# Altium schematic sheet power.SchDoc
size A4
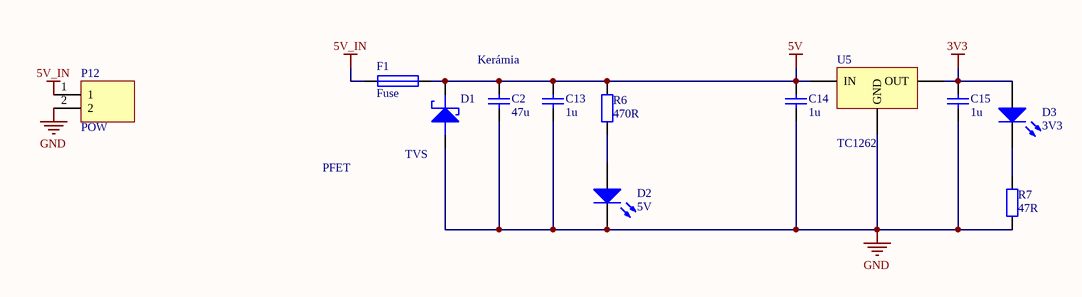
[diagram p0: power.SchDoc]

## Parts
C2  47u  [FP_0805_CAP_085]
C13  1u  [FP_0805_CAP_085]
C14  1u  [FP_0805_CAP_085]
C15  1u  [FP_0805_CAP_085]
D1  TVS  [FP_SMB]
D2  5V  [FP_0805_LED_GREEN]
D3  3V3  [FP_0805_LED_GREEN]
F1  Fuse  [FP_MULTIFUSE]
P12  POW  [FP_CONN2_TAP_254MM_90_NOPRINT]
R6  470R  [FP_0805_RES]
R7  47R  [FP_0805_RES]
U5  TC1262  [FP_SOT223]

## Nets
3V3: C15.2 D3.1(A) U5.3(OUT)
5V: C2.2 C13.2 C14.2 D1.1(CATHODE) F1.2 R6.2 U5.1(IN)
5V_IN: F1.1 P12.1
GND: C2.1 C13.1 C14.1 C15.1 D1.2(ANODE) D2.2(K) P12.2 R7.1 U5.2(GND)
NetD2_1: D2.1(A) R6.1
NetD3_2: D3.2(K) R7.2

## Notes on the sheet
- Kerámia
- PFET

## Library data of the parts
C2 = CAP: Capacitor; Name: 47uF 0805 20% 6.3V X5R 0805X476M6R3NT (FNG); Supplier: Lomex; Reference: 82-14-76; Value: 47u
C13-C15 = CAP: Capacitor; Name: 1uF 0805 -20+80% 50V Y5V 0805F105Z500CT (WAL); Supplier: Lomex; Reference: 82-04-25; Value: 1u
D1 = SCHOTTKY: TVS diode; Name: 6.7V Ubr 400W UNIDIR. 5V Urwm SMAJ5.0A (LFS) DO-214AC (SMA) ˝AE˝; Supplier: Lomex; Reference: 96-00-75
D2 D3 = LED: Typical RED GaAs LED; pin to pad: 1>A 2>K; Name: LED - 2012 GREEN 520nm 1300mcd HL-PSC-2012U51GC (HON); Supplier: Lomex; Reference: 95-03-85
F1 = Fuse: Name: 750mA 24V 1812L075/24DR POLYFUSE SMD 1812 (LFS) ˝LF075-24˝; Reference: 44-02-34; Supplier: Lomex
P12 = Connector_2pin: 2pin connector
R6 = RES: Resistor; Name: 470R 0805 5% WR08X471JTL 0.125W (WAL); Supplier: Lomex; Reference: 81-30-15; Value: 470R
R7 = RES: Resistor; Name: 47R0 0805 5% WR08X470JTL 0.125W (WAL); Supplier: Lomex; Reference: 81-28-06; Value: 47R
U5 = TC1262: Fixed LDO Voltage Regulator; Reference: 1852183; Name: Fixed LDO Voltage Regulator, 2.7V to 6V, 350mV Dropout, 3.3Vout, 500mAout; Supplier: Farnell